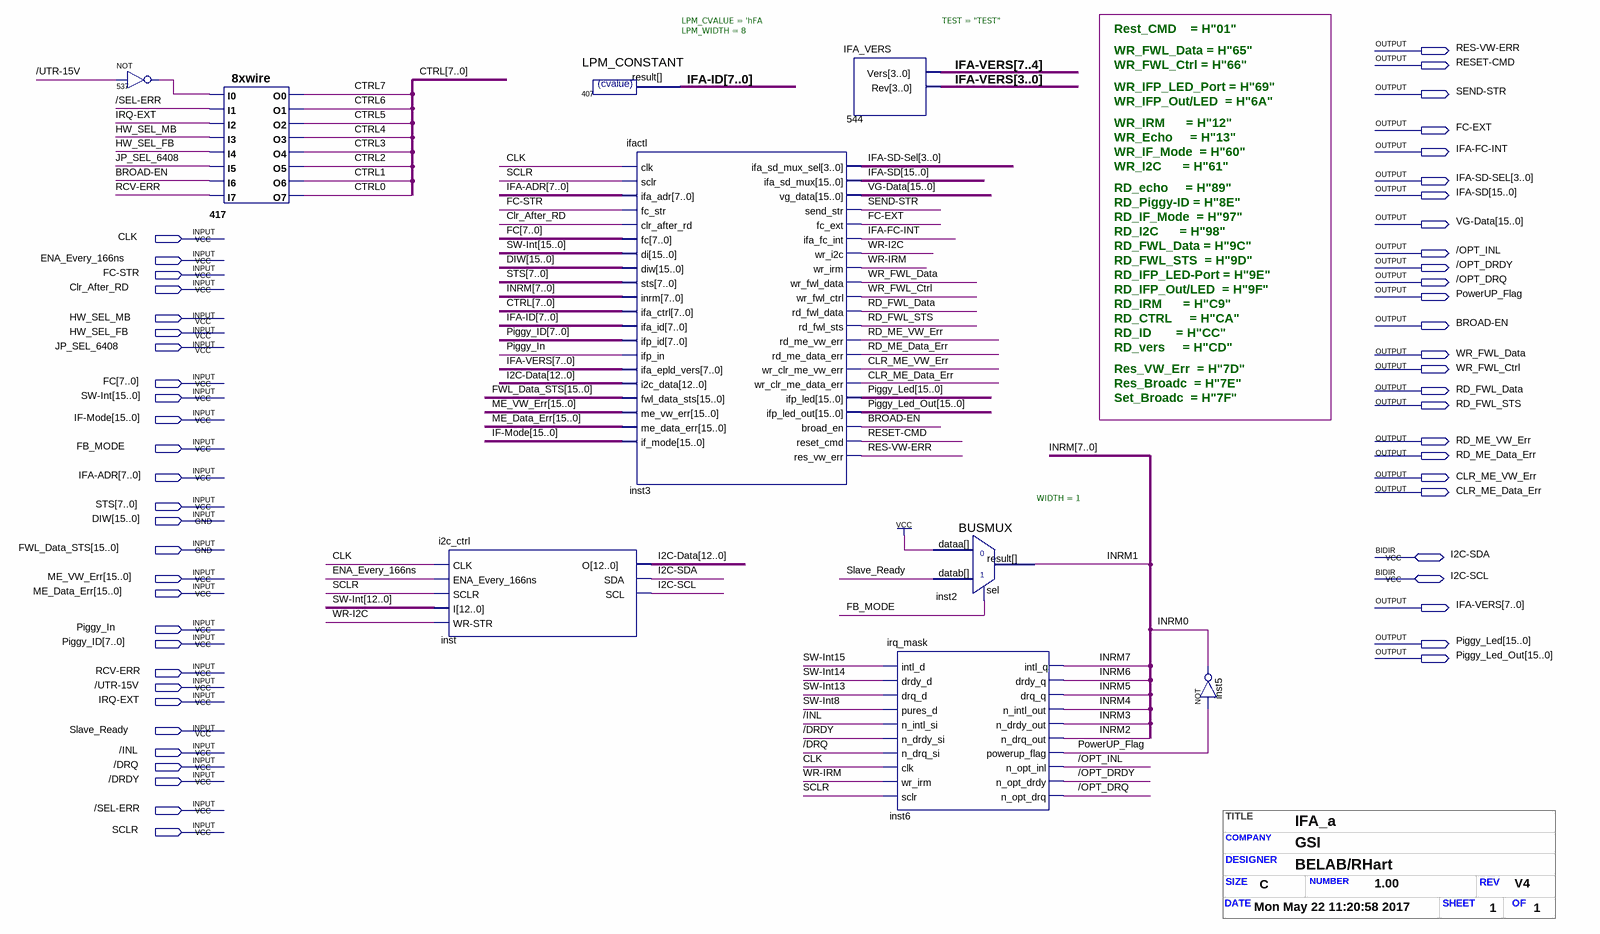
[diagram p0: schematic sheet]
// Quartus schematic ifa_a.bdf as structural Verilog: 9 symbols, 54 pins
// Title block: TITLE: IFA_a; COMPANY: GSI; DESIGNER: BELAB/RHart; SIZE: C; NUMBER: 1.00; REV: V4; DATE: Mon May 22 11:20:58 2017; SHEET: 1; OF: 1
module ifa_a (
  input  CLK,
  input  ENA_Every_166ns,
  input  \FC-STR ,
  input  Clr_After_RD,
  input  HW_SEL_MB,
  input  HW_SEL_FB,
  input  JP_SEL_6408,
  input  [7:0] FC,
  input  [15:0] \SW-Int ,
  input  [15:0] \IF-Mode ,
  input  FB_MODE,
  input  [7:0] \IFA-ADR ,
  input  [7:0] STS,
  input  [15:0] DIW,
  input  [15:0] FWL_Data_STS,
  input  [15:0] ME_VW_Err,
  input  [15:0] ME_Data_Err,
  input  Piggy_In,
  input  [7:0] Piggy_ID,
  input  \RCV-ERR ,
  input  \/UTR-15V ,
  input  \IRQ-EXT ,
  input  Slave_Ready,
  input  \/INL ,
  input  \/DRQ ,
  input  \/DRDY ,
  input  \/SEL-ERR ,
  input  SCLR,
  inout  \I2C-SDA ,
  inout  \I2C-SCL ,
  output \RES-VW-ERR ,
  output \RESET-CMD ,
  output \SEND-STR ,
  output \FC-EXT ,
  output \IFA-FC-INT ,
  output [3:0] \IFA-SD-SEL ,
  output [15:0] \IFA-SD ,
  output [15:0] \VG-Data ,
  output \/OPT_INL ,
  output \/OPT_DRDY ,
  output \/OPT_DRQ ,
  output PowerUP_Flag,
  output \BROAD-EN ,
  output WR_FWL_Data,
  output WR_FWL_Ctrl,
  output RD_FWL_Data,
  output RD_FWL_STS,
  output RD_ME_VW_Err,
  output RD_ME_Data_Err,
  output CLR_ME_VW_Err,
  output CLR_ME_Data_Err,
  output [7:0] \IFA-VERS ,
  output [15:0] Piggy_Led,
  output [15:0] Piggy_Led_Out
);

  wire n537_out, \WR-I2C , \WR-IRM ;
  wire [7:0] CTRL, \IFA-ID , INRM;
  wire [12:0] \I2C-Data ;

  not u_537 (n537_out, \/UTR-15V );
  \8xwire  u_417 (
    .I0(n537_out), .I1(\/SEL-ERR ), .I2(\IRQ-EXT ), .I3(HW_SEL_MB), .I4(HW_SEL_FB), .I5(JP_SEL_6408),
    .I6(\BROAD-EN ), .I7(\RCV-ERR ), .O0(CTRL[7]), .O1(CTRL[6]), .O2(CTRL[5]), .O3(CTRL[4]), .O4(CTRL[3]),
    .O5(CTRL[2]), .O6(CTRL[1]), .O7(CTRL[0]));
  i2c_ctrl inst (
    .CLK(CLK), .ENA_Every_166ns(ENA_Every_166ns), .SCLR(SCLR), .I(\SW-Int [12:0]), .\WR-STR (\WR-I2C ),
    .O(\I2C-Data ), .SDA(\I2C-SDA ), .SCL(\I2C-SCL ));
  LPM_CONSTANT #(.LPM_CVALUE('hFA), .LPM_WIDTH(8)) u_407 (.result(\IFA-ID ));
  ifactl inst3 (
    .clk(CLK), .sclr(SCLR), .ifa_adr(\IFA-ADR ), .fc_str(\FC-STR ), .clr_after_rd(Clr_After_RD), .fc(FC),
    .di(\SW-Int ), .diw(DIW), .sts(STS), .inrm(INRM), .ifa_ctrl(CTRL), .ifa_id(\IFA-ID ), .ifp_id(Piggy_ID),
    .ifp_in(Piggy_In), .ifa_epld_vers(\IFA-VERS ), .i2c_data(\I2C-Data ), .fwl_data_sts(FWL_Data_STS),
    .me_vw_err(ME_VW_Err), .me_data_err(ME_Data_Err), .if_mode(\IF-Mode ), .ifa_sd_mux_sel(\IFA-SD-SEL ),
    .ifa_sd_mux(\IFA-SD ), .vg_data(\VG-Data ), .send_str(\SEND-STR ), .fc_ext(\FC-EXT ),
    .ifa_fc_int(\IFA-FC-INT ), .wr_i2c(\WR-I2C ), .wr_irm(\WR-IRM ), .wr_fwl_data(WR_FWL_Data),
    .wr_fwl_ctrl(WR_FWL_Ctrl), .rd_fwl_data(RD_FWL_Data), .rd_fwl_sts(RD_FWL_STS),
    .rd_me_vw_err(RD_ME_VW_Err), .rd_me_data_err(RD_ME_Data_Err), .wr_clr_me_vw_err(CLR_ME_VW_Err),
    .wr_clr_me_data_err(CLR_ME_Data_Err), .ifp_led(Piggy_Led), .ifp_led_out(Piggy_Led_Out),
    .broad_en(\BROAD-EN ), .reset_cmd(\RESET-CMD ), .res_vw_err(\RES-VW-ERR ));
  IFA_VERS #(.TEST("TEST")) u_544 (.Vers(\IFA-VERS [7:4]), .Rev(\IFA-VERS [3:0]));
  irq_mask inst6 (
    .intl_d(\SW-Int [15]), .drdy_d(\SW-Int [14]), .drq_d(\SW-Int [13]), .pures_d(\SW-Int [8]),
    .n_intl_si(\/INL ), .n_drdy_si(\/DRDY ), .n_drq_si(\/DRQ ), .clk(CLK), .wr_irm(\WR-IRM ), .sclr(SCLR),
    .intl_q(INRM[7]), .drdy_q(INRM[6]), .drq_q(INRM[5]), .n_intl_out(INRM[4]), .n_drdy_out(INRM[3]),
    .n_drq_out(INRM[2]), .powerup_flag(PowerUP_Flag), .n_opt_inl(\/OPT_INL ), .n_opt_drdy(\/OPT_DRDY ),
    .n_opt_drq(\/OPT_DRQ ));
  BUSMUX #(.WIDTH(1)) inst2 (.datab(Slave_Ready), .sel(FB_MODE), .dataa(1'b1), .result(INRM[1]));
  not inst5 (INRM[0], PowerUP_Flag);

  // Notes on the sheet:
  //   Rest_CMD    = H"01"
  //   WR_FWL_Data = H"65"
  //   WR_FWL_Ctrl = H"66"
  //   WR_IFP_LED_Port = H"69"
  //   WR_IFP_Out/LED  = H"6A"
  //   WR_IRM      = H"12"
  //   WR_Echo     = H"13"
  //   WR_IF_Mode  = H"60"
  //   WR_I2C      = H"61"
  //   RD_echo     = H"89"
  //   RD_Piggy-ID = H"8E"
  //   RD_IF_Mode  = H"97"
  //   RD_I2C      = H"98"
  //   RD_FWL_Data = H"9C"
  //   RD_FWL_STS  = H"9D"
  //   RD_IFP_LED-Port = H"9E"
  //   RD_IFP_Out/LED  = H"9F"
  //   RD_IRM      = H"C9"
  //   RD_CTRL     = H"CA"
  //   RD_ID       = H"CC"
  //   RD_vers     = H"CD"
  //   Res_VW_Err  = H"7D"
  //   Res_Broadc  = H"7E"
  //   Set_Broadc  = H"7F"
endmodule
